# EAGLE design DCDC-12V5V5A (EAGLE 9.6.2)
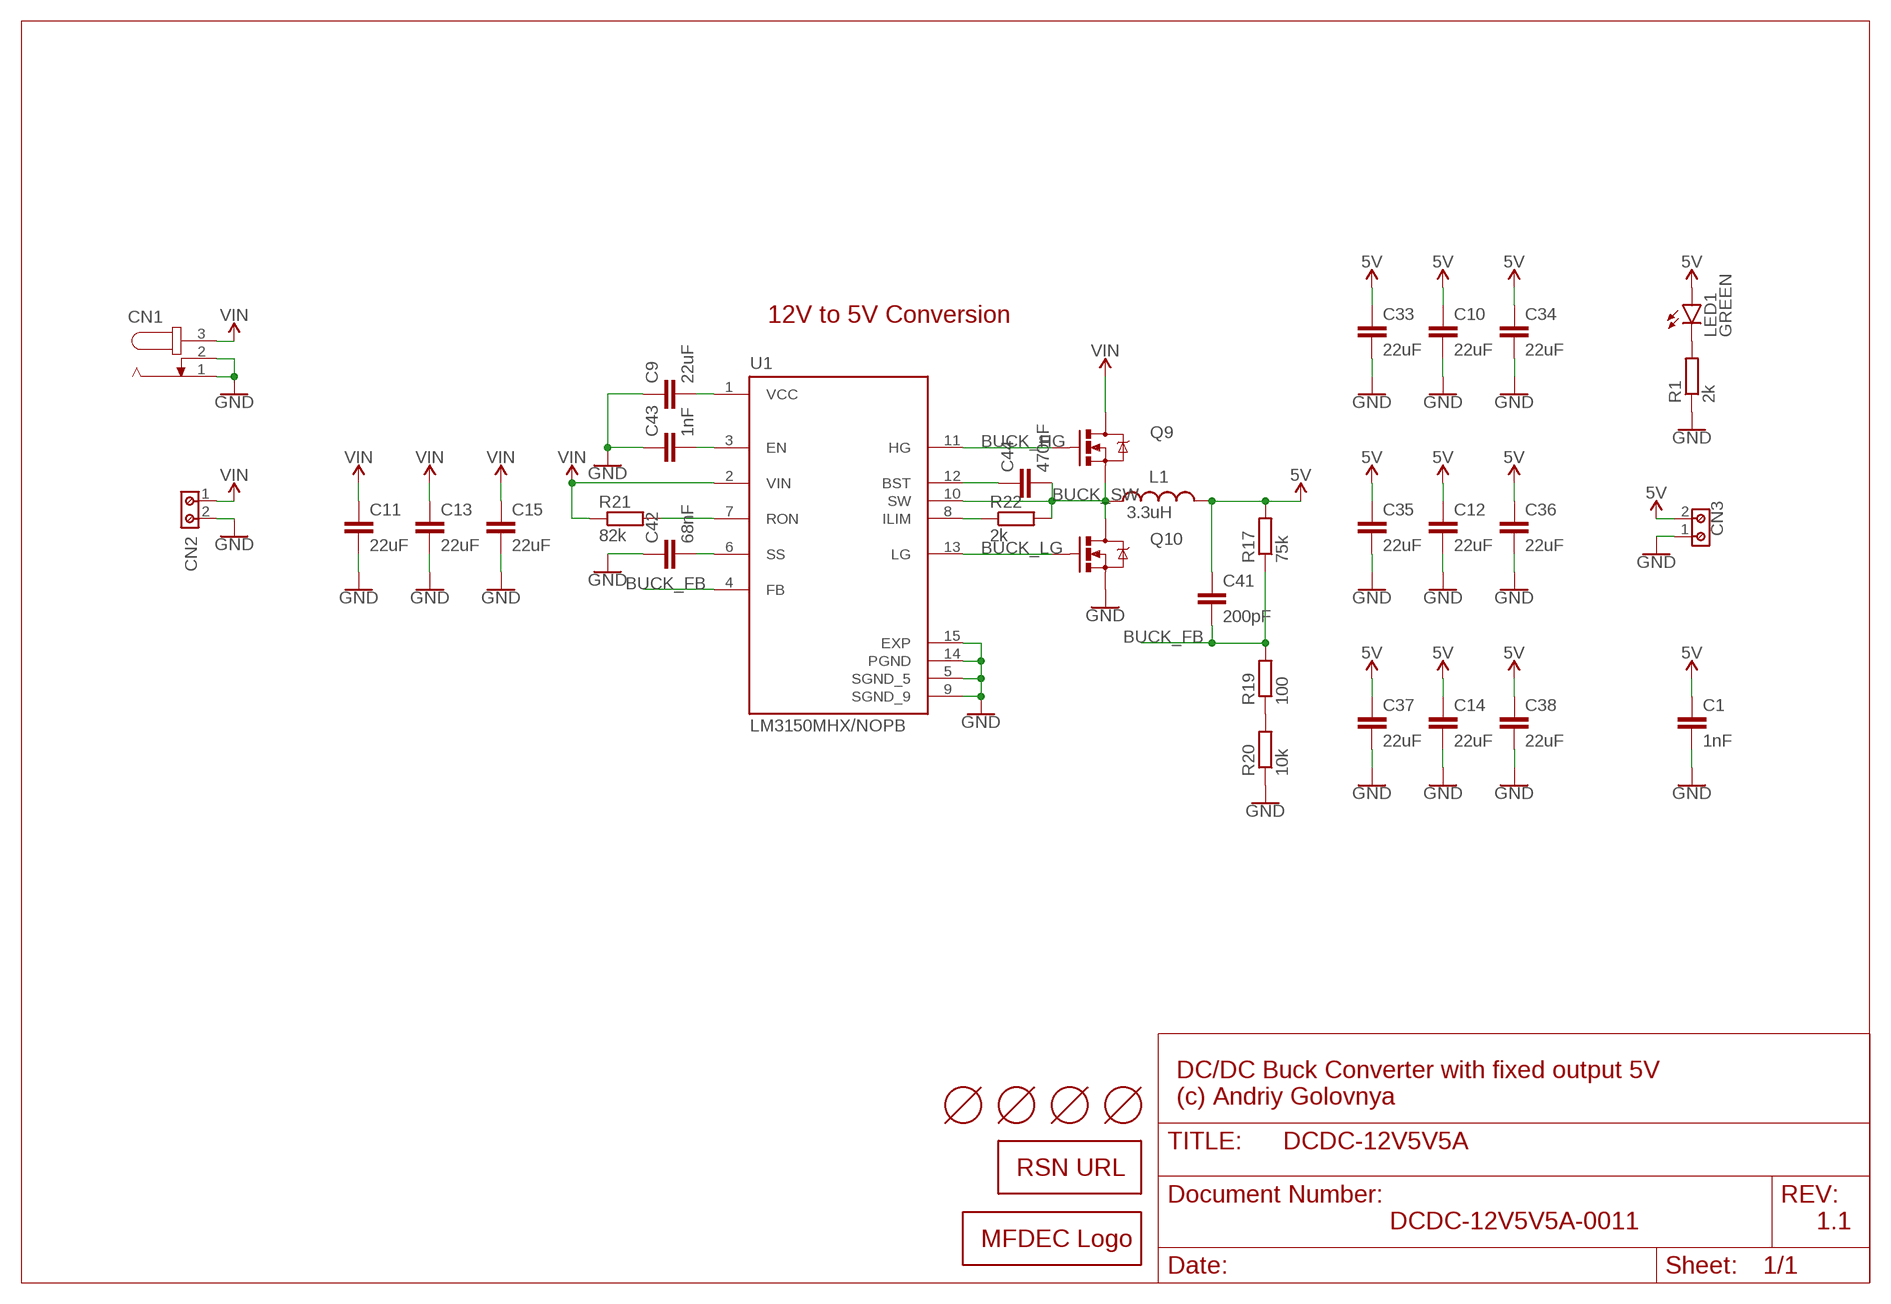
[diagram p0: schematic, sheet 1]

## Parts
C1  1nF  C-EUC0603K  [C0603K]
C9  22uF  C-EUC0805K  [C0805K]
C10  22uF  C-EUC0805K  [C0805K]
C11  22uF  C-EUC0805K  [C0805K]
C12  22uF  C-EUC0805K  [C0805K]
C13  22uF  C-EUC0805K  [C0805K]
C14  22uF  C-EUC0805K  [C0805K]
C15  22uF  C-EUC0805K  [C0805K]
C33  22uF  C-EUC0805K  [C0805K]
C34  22uF  C-EUC0805K  [C0805K]
C35  22uF  C-EUC0805K  [C0805K]
C36  22uF  C-EUC0805K  [C0805K]
C37  22uF  C-EUC0805K  [C0805K]
C38  22uF  C-EUC0805K  [C0805K]
C41  200pF  C-EUC0603K  [C0603K]
C42  68nF  C-EUC0603K  [C0603K]
C43  1nF  C-EUC0603K  [C0603K]
C44  470nF  C-EUC0603K  [C0603K]
CN1  JACK-PLUG1  [SPC4078]
CN2  691213510002  [691213510002]
CN3  691213510002  [691213510002]
HOLE1  TOOLINGHOLE  [TOOLING-HOLE]
HOLE2  TOOLINGHOLE  [TOOLING-HOLE]
HOLE3  TOOLINGHOLE  [TOOLING-HOLE]
HOLE4  TOOLINGHOLE  [TOOLING-HOLE]
L1  3.3uH  WE-CHSA_1011_7843330330  [WE-CHSA_1011]
LED1  GREEN  LEDSML0603  [SML0603]
LOGO1  RSNURL_QR_8MM  [RSNURL_QR_8MM]
LOGO2  MFDECLOGO_L_10MM  [MFDEC_L_10MM]
Q9  NMOSFET  MOSFET-NCHANNELFDD8780  [DPAK]
Q10  NMOSFET  MOSFET-NCHANNELFDD8780  [DPAK]
R1  2k  R-EU_R0603  [R0603]
R17  75k  R-EU_R0603  [R0603]
R19  100  R-EU_R0603  [R0603]
R20  10k  R-EU_R0603  [R0603]
R21  82k  R-EU_R0603  [R0603]
R22  2k  R-EU_R0603  [R0603]
U1  LM3150MHX/NOPB  [SOP65P640X110-15N]

## Nets
5V: C1.1 C10.1 C12.1 C14.1 C33.1 C34.1 C35.1 C36.1 C37.1 C38.1 C41.1 CN3.2 L1.2 LED1.A R17.2
BUCK_BST: C44.1 U1.12(BST)
BUCK_EN: C43.2 U1.3(EN)
BUCK_FB: C41.2 R17.1 R19.2 U1.4(FB)
BUCK_HG: Q9.1(G) U1.11(HG)
BUCK_ILIM: R22.1 U1.8(ILIM)
BUCK_LG: Q10.1(G) U1.13(LG)
BUCK_RON: R21.2 U1.7(RON)
BUCK_SS: C42.2 U1.6(SS)
BUCK_SW: C44.2 L1.1 Q9.3(S) Q10.4(D) R22.2 U1.10(SW)
BUCK_VCC: C9.2 U1.1(VCC)
GND: C1.2 C9.1 C10.2 C11.2 C12.2 C13.2 C14.2 C15.2 C33.2 C34.2 C35.2 C36.2 C37.2 C38.2 C42.1 C43.1 CN1.1 CN1.2 CN2.2 CN3.1 Q10.3(S) R1.1 R20.1 U1.5(SGND_5) U1.9(SGND_9) U1.14(PGND) U1.15(EXP)
N$1: LED1.C R1.2
N$2: R19.1 R20.2
VIN: C11.1 C13.1 C15.1 CN1.3 CN2.1 Q9.4(D) R21.1 U1.2(VIN)

## Notes on the sheet
- 12V to 5V Conversion
- DC/DC Buck Converter with fixed output 5V
  (c) Andriy Golovnya
- DCDC-12V5V5A-0011 | 1.1

## Library data of the parts
C1 C9-C15 C33-C38 C41-C44 = rcl:C-EU: CAPACITOR, European symbol; SPICEPREFIX: C
CN1 = con-jack:JACK-PLUG: DC POWER JACK Power Jack, DC, Right Angle, Through Hole, Rated 5A at 16VDC, PC Terminals Distributor: Farnell (www.Farnell.de) Drawing: 84N1161.pdf / 84N1162.pdf Manufacturer: SPC Technology (www.spctechnology.com) Type: SPC4077 / SPC 4078; OC_FARNELL: unknown; OC_NEWARK: unknown
CN2 CN3 = Wurth_Connectors_WR-TBL Rising Cage Clamp:691213510002: WR-TBL Serie 2135 - 5.08 mm Horizontal Entry Modular w. Rising Cage Clamp KIND PROPERTIES Pitch 5.08 mm MATERIAL PROPERTIES Insulator Material PA66 Insulator Flammability Rating UL94 V-0 Contact Material Copper Alloy Contact Plating Tin over Nickel Contact Type Stamped Terminal Screw Material Steel Terminal Screw Plating Zinc Wire Guard Material Copper Alloy GENERAL INFORMATION Operating Temperature -30 up to +120 °C Compliance ROHS & Reach ELECTRICAL PROPERTIES IR UL 14 A IR VDE 14 A Working Voltage [UL] 300 V (AC) Working Voltage [VDE] 250 V (AC) Withstanding Voltage [UL] 1600 V (AC) Withstanding Voltage [VDE] 2000 V (AC) Contact Resistance 20 mΩ MECHANICAL PROPERTIES Wire Strip Length 6 Screw M3 CERTIFICATION UL Approval E150931 VDE Approval 40021366 PACKAGING PROPERTIES Packaging Box <https://www.we-online.com/catalog/media/o32805v209%20Family_WR-TBL2_Series2135.jpg> Details see: https://www.we-online.com/catalog/en/TBL_5_08_2135_HORIZONTAL_ENTRY_MODULAR_69121351000x/ Updated by Ella Wu 2019-11-26 2019(C) Wurth Elektronik; IR-UL: 14A; IR-VDE: 14A; PART-NUMBER: 691213510002; PINS: 2; PITCH: 5.08mm; TYPE: Horizontal; WIRE: 14 to 30 (AWG) 2.08 to 0.0509 (mm²); WORKING-VOLTAGE-UL: 300V (AC); WORKING-VOLTAGE-VDE: 250V (AC)
HOLE1-HOLE4 = _my_fiducia:TOOLINGHOLE: JLCPCB Tooling Hole
L1 = Wurth_Automotive_WE-CHSA:WE-CHSA_1011: WE-CHSA SMD High Current Inductor Characteristics Magnetically shielded rod core inductor Operating temperature: -55°C to +150°C Current capability up to 28A Ideal coplanarity due to embedded solder pads Applications Filter choke for motor electronics Car infotainment Multimedia applications <https://www.we-online.com/katalog/media/xo107952v209,P20Family_WE-CHSA_78433xxxx_Gruppe_4C.jpg.pagespeed.ic.AyH6nYZeiv.jpg> Details see: https://www.we-online.com/catalog/en/WE-CHSA Updated by Ella Wu 2021-05-13 2021 (C) Wurth Elektronik; DATASHEET-URL: https://www.we-online.com/catalog/datasheet/7843330330.pdf; FRES: 55MHz; IR: 13.8A; ISAT: 20.5A; MOUNT: SMT; PART-NUMBER: 7843330330; RDC-MAX: 6.5mohm; RDC-TYPE: 5.4mohm
LED1 = led:LED: LED OSRAM: - CHIPLED LG R971, LG N971, LY N971, LG Q971, LY Q971, LO R971, LY R971 LH N974, LH R974 LS Q976, LO Q976, LY Q976 LO Q996 - Hyper CHIPLED LW Q18S LB Q993, LB Q99A, LB R99A - SideLED LS A670, LO A670, LY A670, LG A670, LP A670 LB A673, LV A673, LT A673, LW A673 LH A674 LY A675 LS A676, LA A676, LO A676, LY A676, LW A676 LS A679, LY A679, LG A679 - Hyper Micro SIDELED® LS Y876, LA Y876, LO Y876, LY Y876 LT Y87S - SmartLED LW L88C, LW L88S LB L89C, LB L89S, LG L890 LS L89K, LO L89K, LY L89K LS L896, LA L896, LO L896, LY L896 - TOPLED LS T670, LO T670, LY T670, LG T670, LP T670 LSG T670, LSP T670, LSY T670, LOP T670, LYG T670 LG T671, LOG T671, LSG T671 LB T673, LV T673, LT T673, LW T673 LH T674 LS T676, LA T676, LO T676, LY T676, LB T676, LH T676, LSB T676, LW T676 LB T67C, LV T67C, LT T67C, LS T67K, LO T67K, LY T67K, LW E67C LS E67B, LA E67B, LO E67B, LY E67B, LB E67C, LV E67C, LT E67C LW T67C LS T679, LY T679, LG T679 LS T770, LO T770, LY T770, LG T770, LP T770 LB T773, LV T773, LT T773, LW T773 LH T774 LS E675, LA E675, LY E675, LS T675 LS T776, LA T776, LO T776, LY T776, LB T776 LHGB T686 LT T68C, LB T68C - Hyper Mini TOPLED® LB M676 - Mini TOPLED Santana® LG M470 LS M47K, LO M47K, LY M47K Source: http://www.osram.convergy.de LUXEON: - LUMILED® LXK2-PW12-R00, LXK2-PW12-S00, LXK2-PW14-U00, LXK2-PW14-V00 LXK2-PM12-R00, LXK2-PM12-S00, LXK2-PM14-U00 LXK2-PE12-Q00, LXK2-PE12-R00, LXK2-PE12-S00, LXK2-PE14-T00, LXK2-PE14-U00 LXK2-PB12-K00, LXK2-PB12-L00, LXK2-PB12-M00, LXK2-PB14-N00, LXK2-PB14-P00, LXK2-PB14-Q00 LXK2-PR12-L00, LXK2-PR12-M00, LXK2-PR14-Q00, LXK2-PR14-R00 LXK2-PD12-Q00, LXK2-PD12-R00, LXK2-PD12-S00 LXK2-PH12-R00, LXK2-PH12-S00 LXK2-PL12-P00, LXK2-PL12-Q00, LXK2-PL12-R00 Source: www.luxeon.com KINGBRIGHT: KA-3528ASYC Source: www.kingbright.com
LOGO1 = _my_logos:RSNURL: RedScorp.Net URL
LOGO2 = _my_logos:MFDECLOGO: Midnight Fog - Digital Eye Candy LOGO
Q9 Q10 = BeagleBone_Blue_R3:MOSFET-NCHANNEL: Common NMOSFET Parts MFG P/N Store ID Prod ID FDD8780 TRANS-09984 SI7820DN TRANS-11055 FDS6630A IC-08089 2N7002PW TRANS-11151 FQP30N06L COM-10213 TRANS-10060 BSS123LT1G TRANS-08345 BSS138 TRANS-00830 BS170 2N7000; PROD_ID: TRANS-09984
R1 R17 R19-R22 = rcl:R-EU_: RESISTOR, European symbol; SPICEPREFIX: R
U1 = LM3150MHX_NOPB:LM3150MHX/NOPB: 6V to 42V Synchronous Step-Down Controller with Adjustable Output Voltage 14-HTSSOP -40 to 125 Check prices <https://pricing.snapeda.com/parts/LM3150MHX/NOPB/Texas%20Instruments/view-part?ref=eda>; AVAILABILITY: In Stock; DESCRIPTION: 6V to 42V Synchronous Step-Down Controller with Adjustable Output Voltage 14-HTSSOP -40 to 125; MF: Texas Instruments; MP: LM3150MHX/NOPB; PACKAGE: HTSSOP-14 Texas Instruments; PRICE: None; PURCHASE-URL: https://pricing.snapeda.com/search/part/LM3150MHX/NOPB/?ref=eda

## Net classes
0 default: width 0.254 mm

## Board
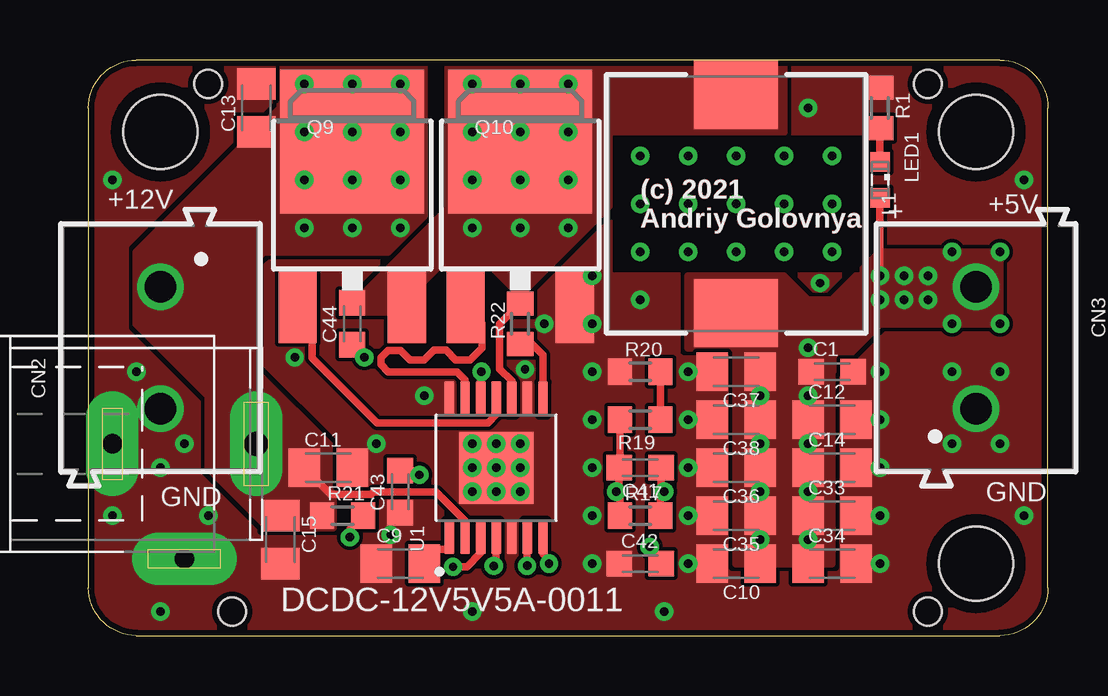
[diagram p1: board, top side]
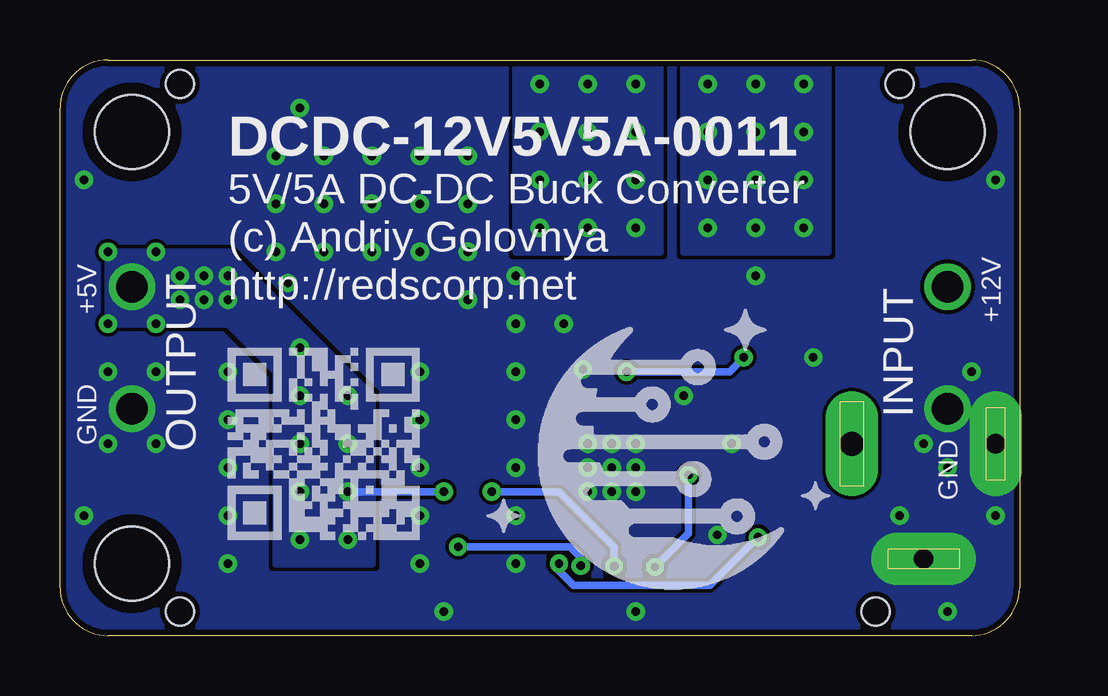
[diagram p2: board, bottom side, seen from below]

Size 40 x 24 mm. Coordinates in mm from the lower left corner, seen from the top.
Outline: 2,0 38,0 arc90 40,2 40,22 arc90 38,24 2,24 arc90 0,22 0,2 arc90 2,0
Copper layers (1*16): Top 0.035mm / dielectric 1.5mm / Bottom 0.035mm
Design rules "default *": minimum track width 6mil, minimum drill 0.35mm, track to track 6mil, track to pad 6mil, pad to pad 6mil, via to via 6mil, smd to smd 6mil, copper to edge 10mil, drill to drill 6mil, minimum pad ring 10mil, minimum via ring 8mil, stop-mask expansion 4mil, vias tented up to drill 20mil, thermal gap 10mil
Holes 3.1 mm at 3,21 37,21 37,3

### Footprints (pad centres in the part's own frame; a part is rotated, then mirrored left to right if it is on the bottom)
C0603K = smd 1.05 x 1.08: 1 -0.875,0; 2 0.875,0
C0805K = smd 1.3 x 1.6: 1 -1,0; 2 1,0
SPC4078 = drill 0.8 pad 2.184 long: 1 -3,0; 2 0,-4.8 | drill 1 pad 2.184 long: 3 3,0
691213510002 = drill 1.3: 1 -2.54,0; 2 2.54,0
TOOLING-HOLE = hole 1.153: 0,0
WE-CHSA_1011 = smd 2.85 x 3.5: 1 -4.55,0; 2 4.55,0
SML0603 = smd 0.8 x 0.8: A 0.75,0; C -0.75,0
DPAK = smd 1.6 x 2.997: 1 -2.28,-5.31; 3 2.28,-5.31 | smd 5.994 x 5.994: 4 0,1.588
R0603 = smd 1 x 1.1: 1 -0.85,0; 2 0.85,0
SOP65P640X110-15N = smd 1.44 x 0.41: 1 -2.885,1.95; 2 -2.885,1.3; 3 -2.885,0.65; 4 -2.885,0; 5 -2.885,-0.65; 6 -2.885,-1.3; 7 -2.885,-1.95; 8 2.885,-1.95; 9 2.885,-1.3; 10 2.885,-0.65; 11 2.885,0; 12 2.885,0.65; 13 2.885,1.3; 14 2.885,1.95 | smd 3 x 3.1: 15 0,0

### Placement (x,y rotation side)
C1  31,11 0 top
C9  13,3 0 top
C10  27,3 180 top
C11  10,7 0 top
C12  31,9 0 top
C13  7,22 90 top
C14  31,7 0 top
C15  8,4 270 top
C33  31,5 0 top
C34  31,3 0 top
C35  27,5 180 top
C36  27,7 180 top
C37  27,11 180 top
C38  27,9 180 top
C41  23,7 180 top
C42  23,3 0 top
C43  13,6 90 top
C44  11,13 90 top
CN1  4,8 0 top
CN2  3,12 270 top
CN3  37,12 90 top
HOLE1  35,23 0 top
HOLE2  5,23 0 top
HOLE3  6,1 0 top
HOLE4  35,1 0 top
L1  27,18 270 top
LED1  33,19 270 top
LOGO1  33,4 0 bottom
LOGO2  23,1 0 bottom
Q9  11,19 0 top
Q10  18,19 0 top
R1  33,22 270 top
R17  23,5 0 top
R19  23,9 180 top
R20  23,11 0 top
R21  10.6,5 0 top
R22  18,13 90 top
U1  17,7 90 top

### Tracks (layer width: path | path; a pad name or v marks a point on that pad's centre or on a via)
5V  (via drill 0.35)
  Top 0.305: R17.2 23.85,5.85 v24,6 23.88,6.12 C41.1 | LED1.A v33,15
  Bottom 0.305: v28,6 v24,6
  other vias: 28,10 28,8 28,4 30,4 30,6 30,8 30,10 35,15 35,14 34,15 34,14 33,14 30,12 38,16 36,16 36,13 38,13
  pour Top (no thermals): 25,15 25,12 27,12 27,3 31,3 31,11 33,13 38,13 38,16 33,16 31,14 30,14 29,15
  pour Bottom (no thermals): 38,13 38,16 33,16 27,10 27,3 31,3 31,11 33,13
BUCK_BST  (via drill 0.35)
  Top 0.305: U1.12 16.35,10.97 v16.38,11 | v11.5,11.6 11,12.1 C44.1
  Bottom 0.305: v16.38,11 12.1,11 v11.5,11.6
BUCK_EN  (via drill 0.35)
  Top 0.305: U1.3 16.35,3.44 15.78,2.86 v15.2,2.86 | v13.8,6.7 13.62,6.88 C43.2
  Bottom 0.305: v15.2,2.86 13.8,4.26 v13.8,6.7
BUCK_FB  (via drill 0.35)
  Top 0.305: U1.4 17,3.12 16.9,3.02 v16.9,2.9 | R17.1 22.15,5.85 v22,6 22.12,6.12 C41.2 22.15,7.03 R19.2
  Bottom 0.305: v16.9,2.9 16.9,3.7 19.2,6 v22,6
BUCK_HG
  Top 0.305: U1.11 17,9.21 16.65,8.86 12.04,8.86 9.32,11.58 9.32,13.09 Q9.1
BUCK_ILIM
  Top 0.305: U1.8 18.95,11.7 18.5,12.15 R22.1
BUCK_LG
  Top 0.305: U1.13 15.7,10.66 15.36,11 12.5,11 12.2,11.3 12.2,11.6 12.49,11.89 13.01,11.89 13.4,11.5 14,11.5 14.4,11.9 14.9,11.9 15.3,11.5 15.9,11.5 16.4,12 16.4,13.01 Q10.1
BUCK_RON  (via drill 0.35)
  Top 0.305: v19.2,3 19.2,3.17 18.95,3.42 U1.7 | v10.9,4.1 10.9,4.45 R21.2
  Bottom 0.305: v19.2,3 19.2,2.7 18.6,2.1 12.9,2.1 v10.9,4.1
BUCK_SS  (via drill 0.35)
  Top 0.305: U1.6 18.3,3.44 18.29,3.43 v18.29,2.91 | v23.4,3.7 23.88,3.23 C42.2
  Bottom 0.305: v18.29,2.91 18.32,2.94 18.32,3.28 18.73,3.7 v23.4,3.7
BUCK_SW  (via drill 0.35)
  Top 0.305: U1.10 17.65,10.62 17.14,11.12 17.14,12.99 R22.2
  other vias: 16,23 18,23 20,23 20,21 18,21 16,21 16,19 18,19 20,19 20,17 18,17 16,17
  pour Top (no thermals): 11.3,13.5 11.3,14.1 15,17.8 15,24 29,24 29,21 22,21 22,18.2 18,14.2 16.7,15.5 14.7,15.5 13.9,14.7 13.9,13.5
  pour Bottom (no thermals): 15,24 15,16 21,16 21,24
BUCK_VCC
  Top 0.305: U1.1 15.05,3.75 14.9,3.6 14.6,3.6 C9.2
GND  (via drill 0.35)
  other vias: 16,8 18,8 18,6 16,6 25,3 25,5 25,7 25,9 25,11 33,11 33,9 33,7 33,5 33,3 30.5,14.7 30,22 39,19 39,5 3,7 5,5 1,5 1,19 17,8 17,7 17,6 16,7 18,7 21,15 21,13 19,13 21,11 23,14 21,5 21,3 21,9 21,7 11,15 8.6,11.6 14,10 38,11 36,11 38,8 36,8 4,8 2,11 3,1 12,8 12.6,4.2 24,1 16,1 18.2,11.1 23,20 25,20 27,20 29,20 31,20 31,18 31,16 29,16 27,16 25,16 23,16 23,18 25,18 27,18 29,18
  pour Top (rank 3, no thermals): 40,0 -5,0 -5,24 40,24
  pour Bottom (rank 3, no thermals): 0,24 0,0 45,0 45,24
  cutout Top: 37,1 arc-180 37,5 arc-180
  cutout Top: 37,19 arc-180 37,23 arc-180
  cutout Top: 3,19 arc-180 3,23 arc-180
  cutout Bottom: 3,19 arc-180 3,23 arc-180
  cutout Bottom: 37,19 arc-180 37,23 arc-180
  cutout Bottom: 37,1 arc-180 37,5 arc-180
N$1
  Top 0.305: LED1.C R1.2
N$2
  Top 0.305: R19.1 R20.2
VIN  (via drill 0.35)
  Top 0.305: U1.2 15.7,4.79 14.49,6 11.88,6 11.78,5.89 10.11,5.89 C11.1
  other vias: 11,23 13,23 9,23 9,21 11,21 13,21 13,19 11,19 9,19 9,17 11,17 13,17
  pour Top (no thermals): 7.5,4.5 10.2,4.5 10.2,7.8 7,11 7,15.7 7.3,16 12.5,16 14,17.5 14,24 8,24 8,22 2,16 2,13 5,10 5,7
  pour Bottom (no thermals): 8,24 8,16 14,16 14,24

### Text on the board
Top: (c) 2021 / Andriy Golovnya
tPlace: +12V | +5V | (c) 2021 / Andriy Golovnya | + | GND | GND | DCDC-12V5V5A-0011
bPlace: DCDC-12V5V5A-0011 | 5V/5A DC-DC Buck Converter | +12V | (c) Andriy Golovnya | +5V | OUTPUT | INPUT | http://redscorp.net | GND | GND